# EAGLE design temperatureSensor (EAGLE 9.6.2)
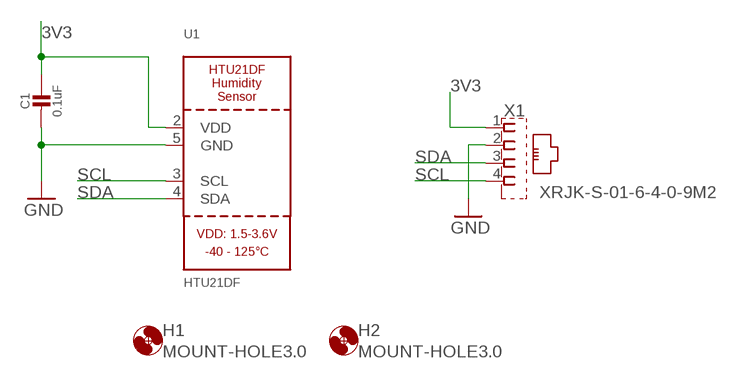
[diagram p0: schematic, sheet 1]

## Parts
C1  0.1uF  CAP_CERAMIC0805-NOOUTLINE  [0805-NO]
H1  MOUNT-HOLE3.0  [3,0]
H2  MOUNT-HOLE3.0  [3,0]
U1  HTU21DF  [HTU21DF]
X1  XRJK-S-01-6-4-0-9M2  [XRJK-S-01-6-4-0-9M2]

## Nets
3V3: C1.1 U1.2(VDD) X1.1
GND: C1.2 U1.5(GND) X1.2
SCL: U1.3(SCL) X1.4
SDA: U1.4(SDA) X1.3

## Library data of the parts
C1 = microbuilder:CAP_CERAMIC: Ceramic Capacitors For new designs, use the packages preceded by an '_' character since they are more reliable: The following footprints should be used on most boards: _0402 - Standard footprint for regular board layouts _0603 - Standard footprint for regular board layouts _0805 - Standard footprint for regular board layouts _1206 - Standard footprint for regular board layouts For extremely tight-pitch boards where space is at a premium, the following 'micro-pitch' footprints can be used (smaller pads, no silkscreen outline, etc.): _0402MP - Micro-pitch footprint for very dense/compact boards _0603MP - Micro-pitch footprint for very dense/compact boards _0805MP - Micro-pitch footprint for very dense/compact boards _1206MP - Micro-pitch footprint for very dense/compact boards
H1 H2 = holes:MOUNT-HOLE: MOUNTING HOLE with drill center marker
U1 = microbuilder:HTU21DF: HTU21DF - Relative Humidity and Temperature Sensor
X1 = pechera:XRJK*4: RJ11 Connector without LED, 6 position, 4 contacts, thrue hole Source: XRJK-S-01-6-4-0-9M2(01).pdf

## Board
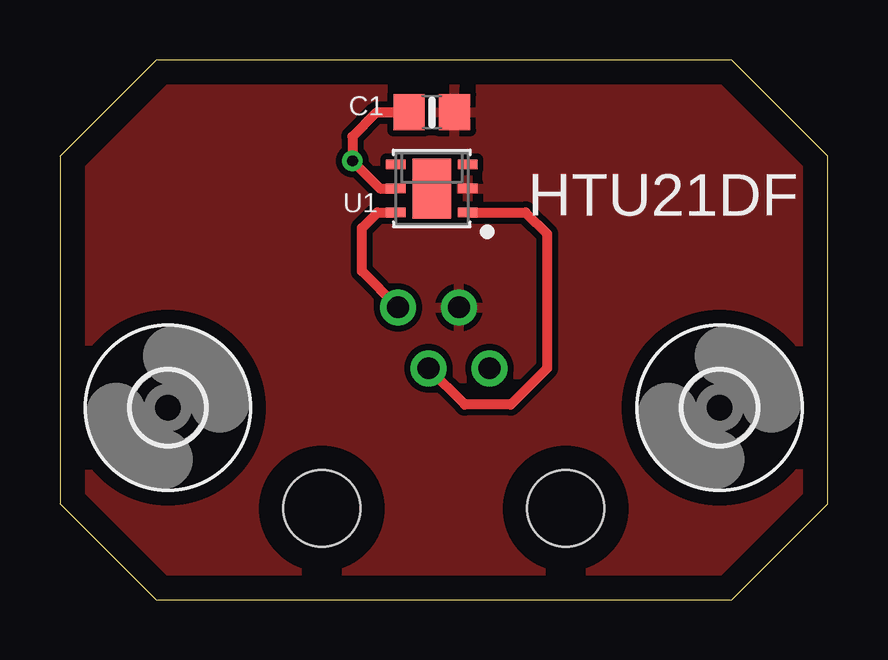
[diagram p1: board, top side]
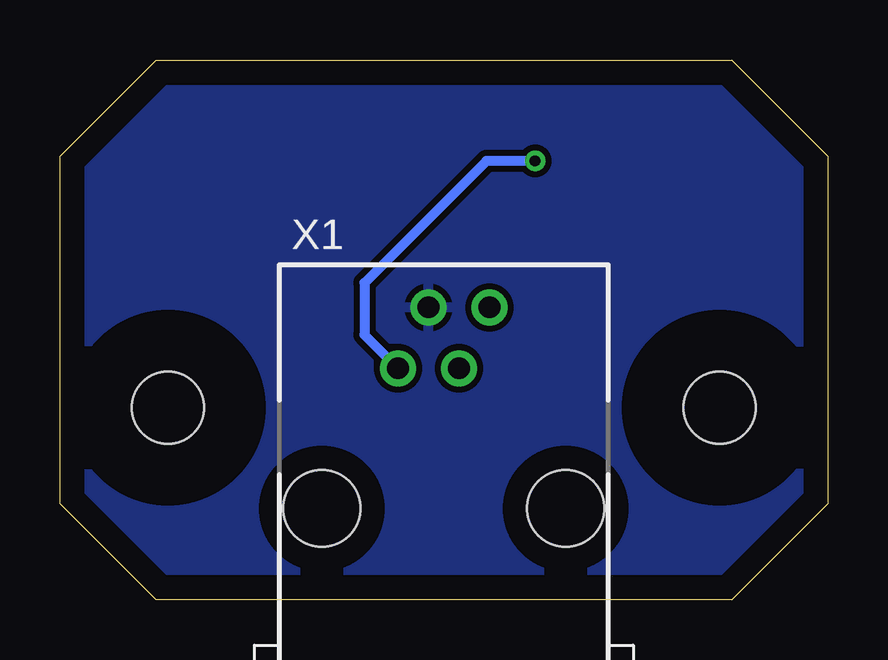
[diagram p2: board, bottom side, seen from below]

Size 32 x 22.5 mm. Coordinates in mm from the lower left corner, seen from the top.
Outline: 4,0 28,0 32,4 32,18.5 28,22.5 4,22.5 0,18.5 0,4 4,0
Copper layers (1*16): Top 0.035mm / dielectric 1.5mm / Bottom 0.035mm
Design rules "default *": minimum track width 6mil, minimum drill 0.35mm, track to track 10mil, track to pad 10mil, pad to pad 10mil, via to via 10mil, smd to smd 6mil, copper to edge 40mil, drill to drill 6mil, minimum pad ring 10mil, minimum via ring 8mil, stop-mask expansion 4mil, vias tented up to drill 0mil, thermal gap 10mil

### Footprints (pad centres in the part's own frame; a part is rotated, then mirrored left to right if it is on the bottom)
0805-NO = smd 1.3 x 1.5: 1 -0.95,0; 2 0.95,0
3,0 = hole 3: 0,0
HTU21DF = smd 0.8 x 0.4: 1 -1.5,1; 2 -1.5,0; 3 -1.5,-1; 4 1.5,-1; 5 1.5,0; 6 1.5,1 | smd 1.6 x 2.5: PAD 0,0
XRJK-S-01-6-4-0-9M2 = drill 0.9 pad 1.5: 1 -1.905,5.842; 2 -0.635,8.382; 3 0.635,5.842; 4 1.905,8.382 | hole 3.2: -5.08,0; 5.08,0

### Placement (x,y rotation side)
C1  15.5,20.32 0 top
H1  4.5,8 0 top
H2  27.5,8 0 top
U1  15.5,17.14 0 top
X1  16,3.8 0 bottom

### Tracks (layer width: path | path; a pad name or v marks a point on that pad's centre or on a via)
3V3  (via drill 0.45)
  Top 0.406: U1.2 13.34,17.14 v12.19,18.29 12.19,19.3 13.21,20.32 C1.1
  Bottom 0.406: v12.19,18.29 14.22,18.29 19.3,13.21 19.3,11.04 X1.1
GND
  pour Bottom: 0,0 0,22.5 32,22.5 32,0
  pour Top: 0,0 0,22.5 32,22.5 32,0
SCL
  Top 0.406: U1.3 13.24,16.14 12.59,15.49 12.59,13.69 X1.4
SDA
  Top 0.406: U1.4 19.41,16.14 20.32,15.24 20.32,9.65 18.8,8.13 16.88,8.13 X1.3

### Text on the board
tPlace: HTU21DF